# Altium schematic sheet WirelessMonitorSch.SchDoc: Wireless Monitor for Evolocity
size A4; Author: Duleepa J Thrimawithana; Organization: The University of Auckland; Address1: 20 Symonds Street; Address2: Auckland CBD; Address3: Auckland; Address4: https://www.auckland.ac.nz/; Revision: Rev 2.0; SheetNumber: 1; SheetTotal: 1
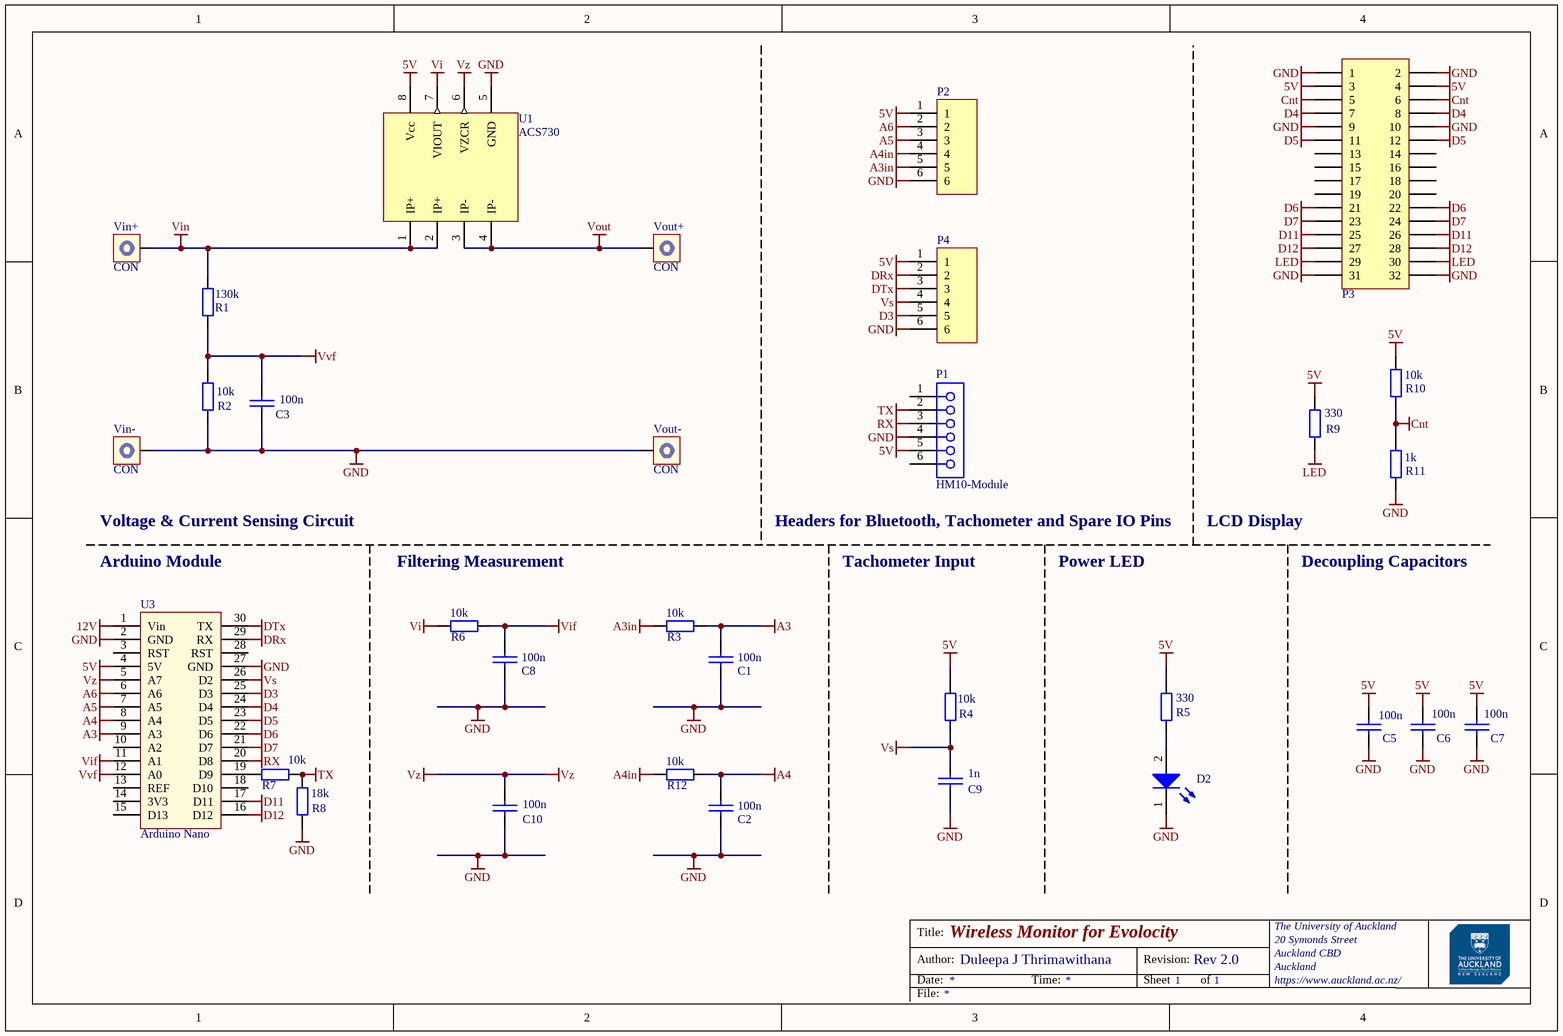
[diagram p0: WirelessMonitorSch.SchDoc]

## Parts
C1  100n  [C0805]
C2  100n  [C0805]
C3  100n  [C0805]
C5  100n  [C0805]
C6  100n  [C0805]
C7  100n  [C0805]
C8  100n  [C0805]
C9  1n  [C0805]
C10  100n  [C0805]
D2  LGR971-KN-1  [FP-LG_R971-MFG]  (value not drawn)
P1  HM10-Module  [SMTC-SSW-106-02-X-S]
P2  Header 6X1  [HDR6X1_2P54]  (value not drawn)
P3  HDR16X2  [HDR16X2_2P54]  (value not drawn)
P4  Header 6X1  [HDR6X1_2P54]  (value not drawn)
R1  130k  [R0805]
R2  10k  [R0805]
R3  10k  [R0805]
R4  10k  [R0805]
R5  330  [R0805]
R6  10k  [R0805]
R7  10k  [R0805]
R8  18k  [R0805]
R9  330  [R0805]
R10  10k  [R0805]
R11  1k  [R0805]
R12  10k  [R0805]
U1  ACS730  [SOIC8]
U3  Arduino Nano  [ArduinoNanoSMT]
Vin+  CON  [CON_M3]
Vin-  CON  [CON_M3]
Vout+  CON  [CON_M3]
Vout-  CON  [CON_M3]

## Nets
5V: C5.2 C6.2 C7.2 P1.5 P2.1 P3.3 P3.4 P4.1 R4.2 R5.2 R9.2 R10.2 U1.8(Vcc) U3.4(5V)
12V: U3.1(Vin)
A3: C1.2 R3.1 U3.9(A3)
A3in: P2.5 R3.2
A4: C2.2 R12.1 U3.8(A4)
A4in: P2.4 R12.2
A5: P2.3 U3.7(A5)
A6: P2.2 U3.6(A6)
Cnt: P3.5 P3.6 R10.1 R11.2
D3: P4.5 U3.25(D3)
D4: P3.7 P3.8 U3.24(D4)
D5: P3.11 P3.12 U3.23(D5)
D6: P3.21 P3.22 U3.22(D6)
D7: P3.23 P3.24 U3.21(D7)
D11: P3.25 P3.26 U3.17(D11)
D12: P3.27 P3.28 U3.16(D12)
DRx: P4.2 U3.29(RX)
DTx: P4.3 U3.30(TX)
GND: C1.1 C2.1 C3.1 C5.1 C6.1 C7.1 C8.1 C9.1 C10.1 D2.1(C) P1.4 P2.6 P3.1 P3.2 P3.9 P3.10 P3.31 P3.32 P4.6 R2.1 R8.1 R11.1 U1.5(GND) U3.2(GND) U3.27(GND) Vin-.1 Vout-.1
LED: P3.29 P3.30 R9.1
RX: P1.3 U3.20(D8)
TX: P1.2 R7.1 R8.2
Vi: R6.2 U1.7(VIOUT)
Vif: C8.2 R6.1 U3.11(A1)
Vin: R1.2 U1.1(IP+) U1.2(IP+) Vin+.1
Vout: U1.3(IP-) U1.4(IP-) Vout+.1
Vs: C9.2 P4.4 R4.1 U3.26(D2)
Vvf: C3.2 R1.1 R2.2 U3.12(A0)
Vz: C10.2 U1.6(VZCR) U3.5(A7)
NetD2_2: D2.2(A) R5.1
NetR7_2: R7.2 U3.19(D9)

Not connected (* = marked no-connect by the designer): P1 1 6; P3 13 14 15 16 17 18 19 20; U3 3(RST) 10(A2) 13(REF) 14(3V3) 15(D13) 18(D10) 28(RST)

## Notes on the sheet
- Voltage & Current Sensing Circuit
- Arduino Module
- Filtering Measurement
- (near P1) Headers for Bluetooth, Tachometer and Spare IO Pins
- Tachometer Input
- Power LED
- LCD Display
- Decoupling Capacitors
- Title:
- Author:
- Date:
- Time:
- Revision:
- Sheet
- of
- File:

## Library data of the parts
C1-C3 C5-C10 = CCAP0805
  C1-C3 C5-C8 C10: LCSC Part Number: C49678
  C9: LCSC Part Number: C46653
D2 = CMP-007-00001-2: LED Uni-Color Green 572nm 2-Pin SMD T/R; LCSC Part Number: C2297
P1 = CMP-002-00001-2: CONN RCPT 6POS 0.1 TIN PCB
P2 P4 = HDR6X1: Header, 6-Pin; LatestRevisionDate: 17-Jul-2002; LatestRevisionNote: Re-released for DXP Platform.; Publisher: Altium Limited
P3 = HDR16X2: Header, 16-Pin, Dual row
R1-R12 = RES0805
  R1: LCSC Part Number: C25617
  R2-R4 R6 R7 R10 R12: LCSC Part Number: C17414
  R5 R9: LCSC Part Number: C17630
  R8: LCSC Part Number: C17506
  R11: LCSC Part Number: C17513
U3 = ArduinoNano
Vin+ Vin- Vout+ Vout- = Connector: Term; Part Number: 74651194R; Rated Current: 85 A; Published Date: Jan 2017; Publisher: Wurth Elektronik; Size: M4, thread 5mm; Packaging: Tape and Reel
U1 = ACS730: Supplier 1: Digikey; Supplier Part Number 1: 620-1794-6-ND